# EAGLE schematic HASP_Electronics (EAGLE 9.0.1)
Relay1
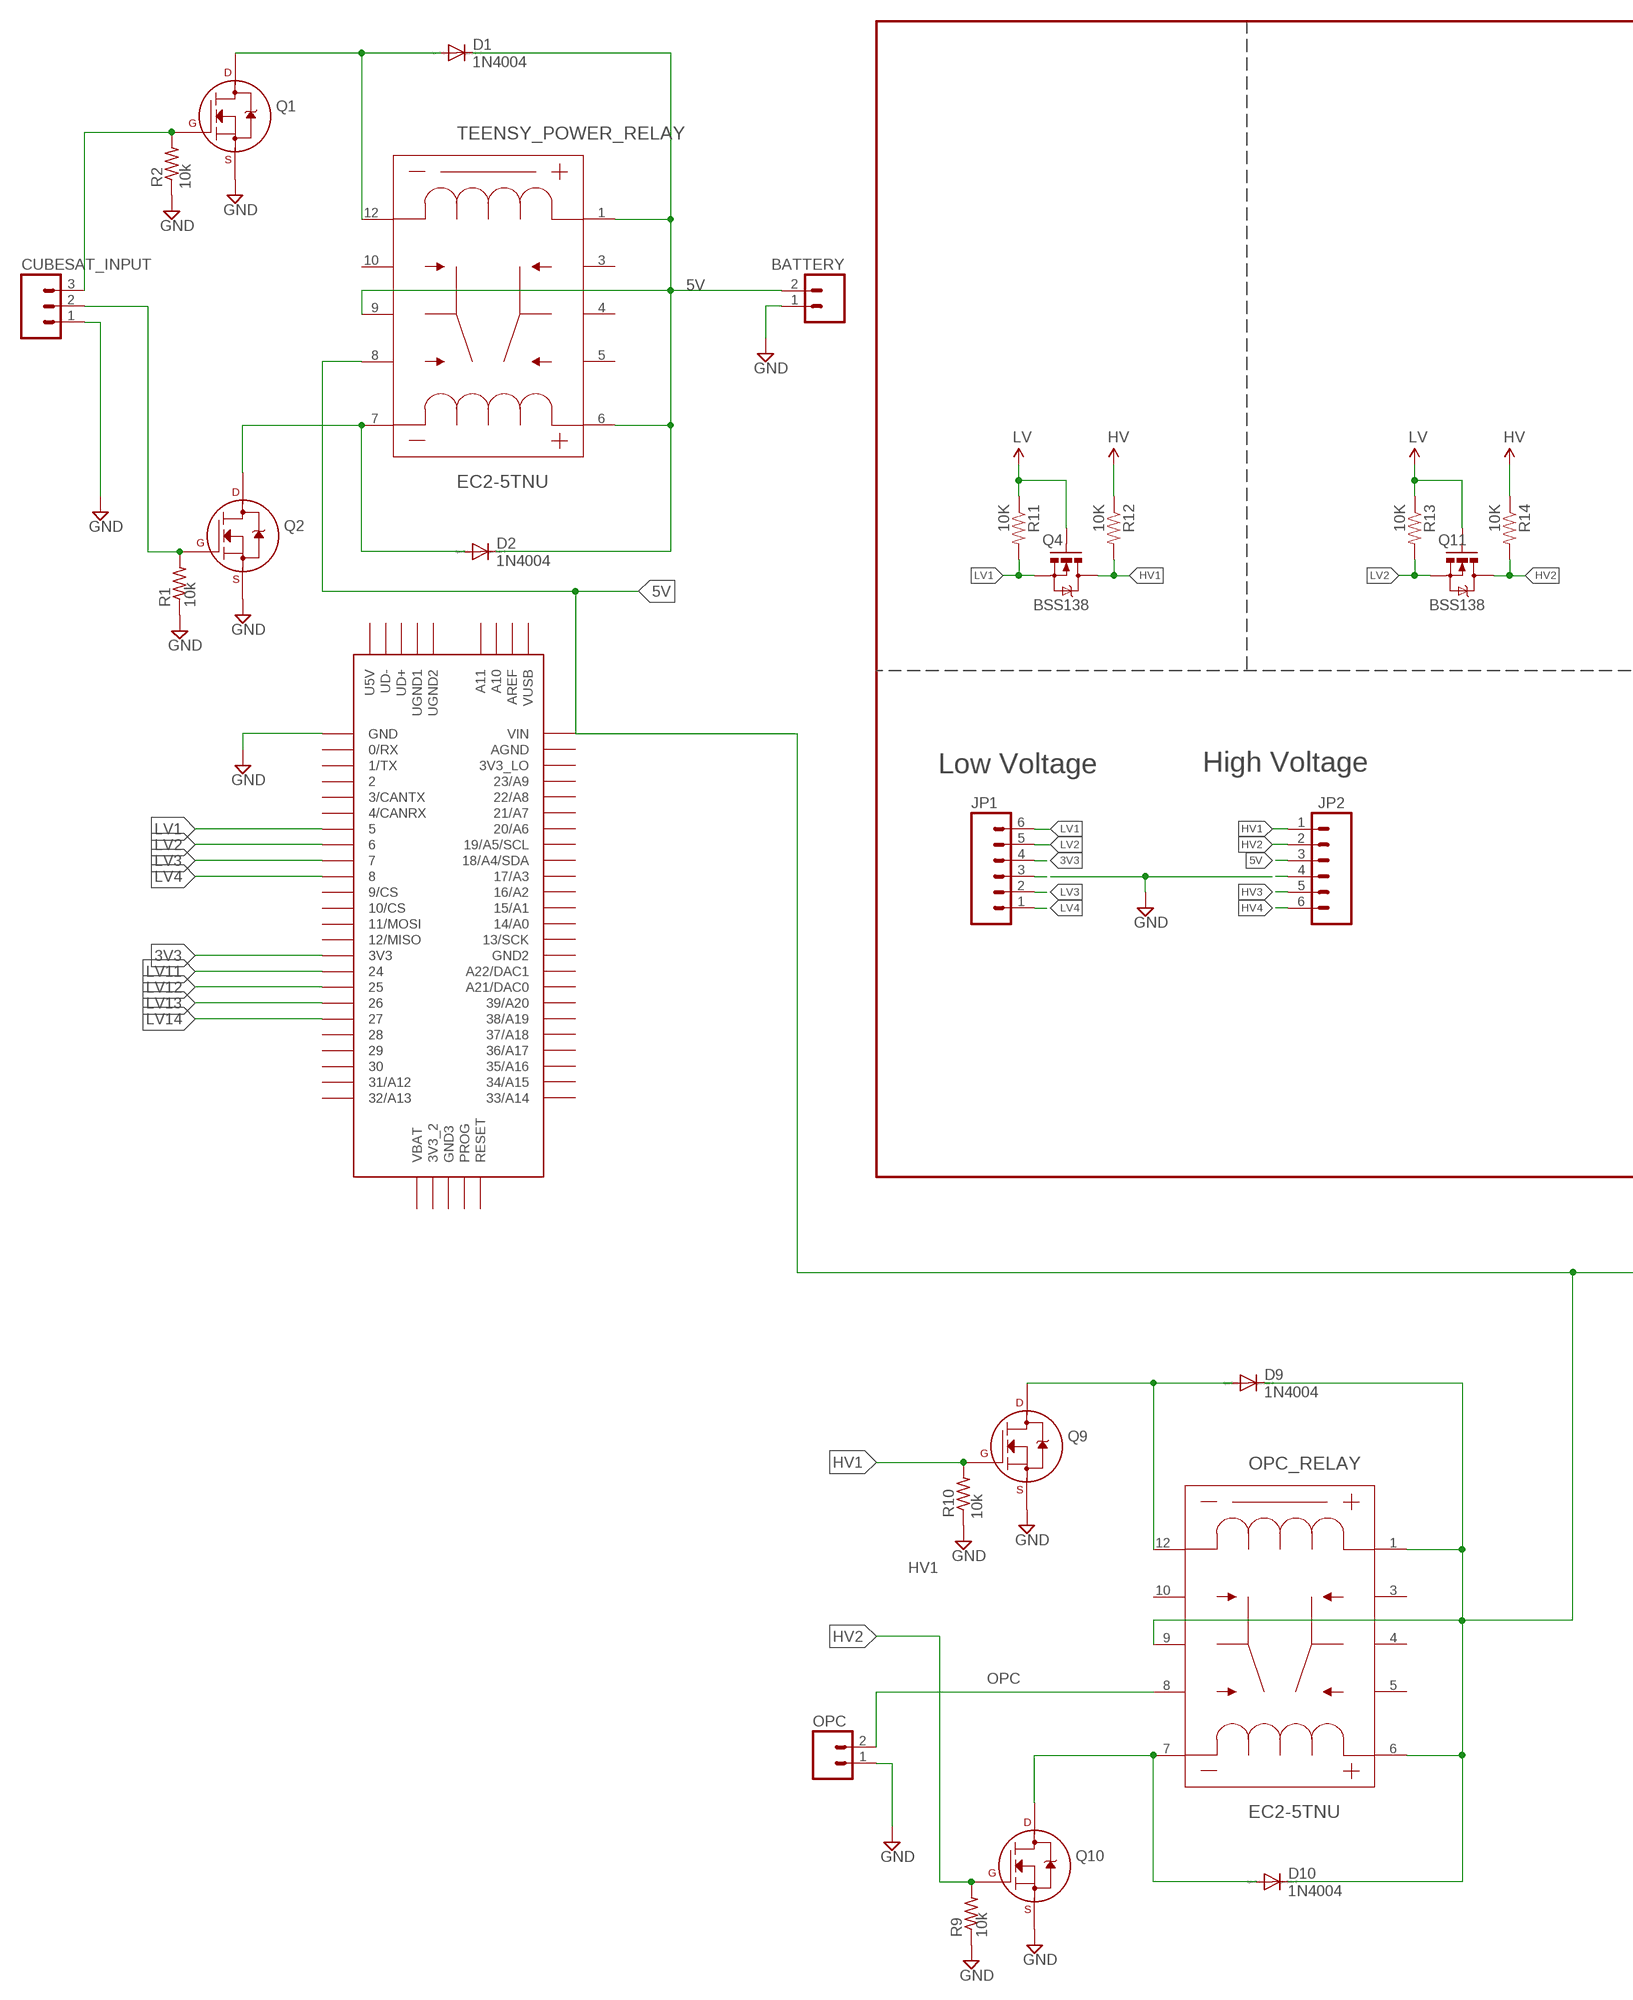
[diagram p0: schematic, sheet 1, part 1 of 2]
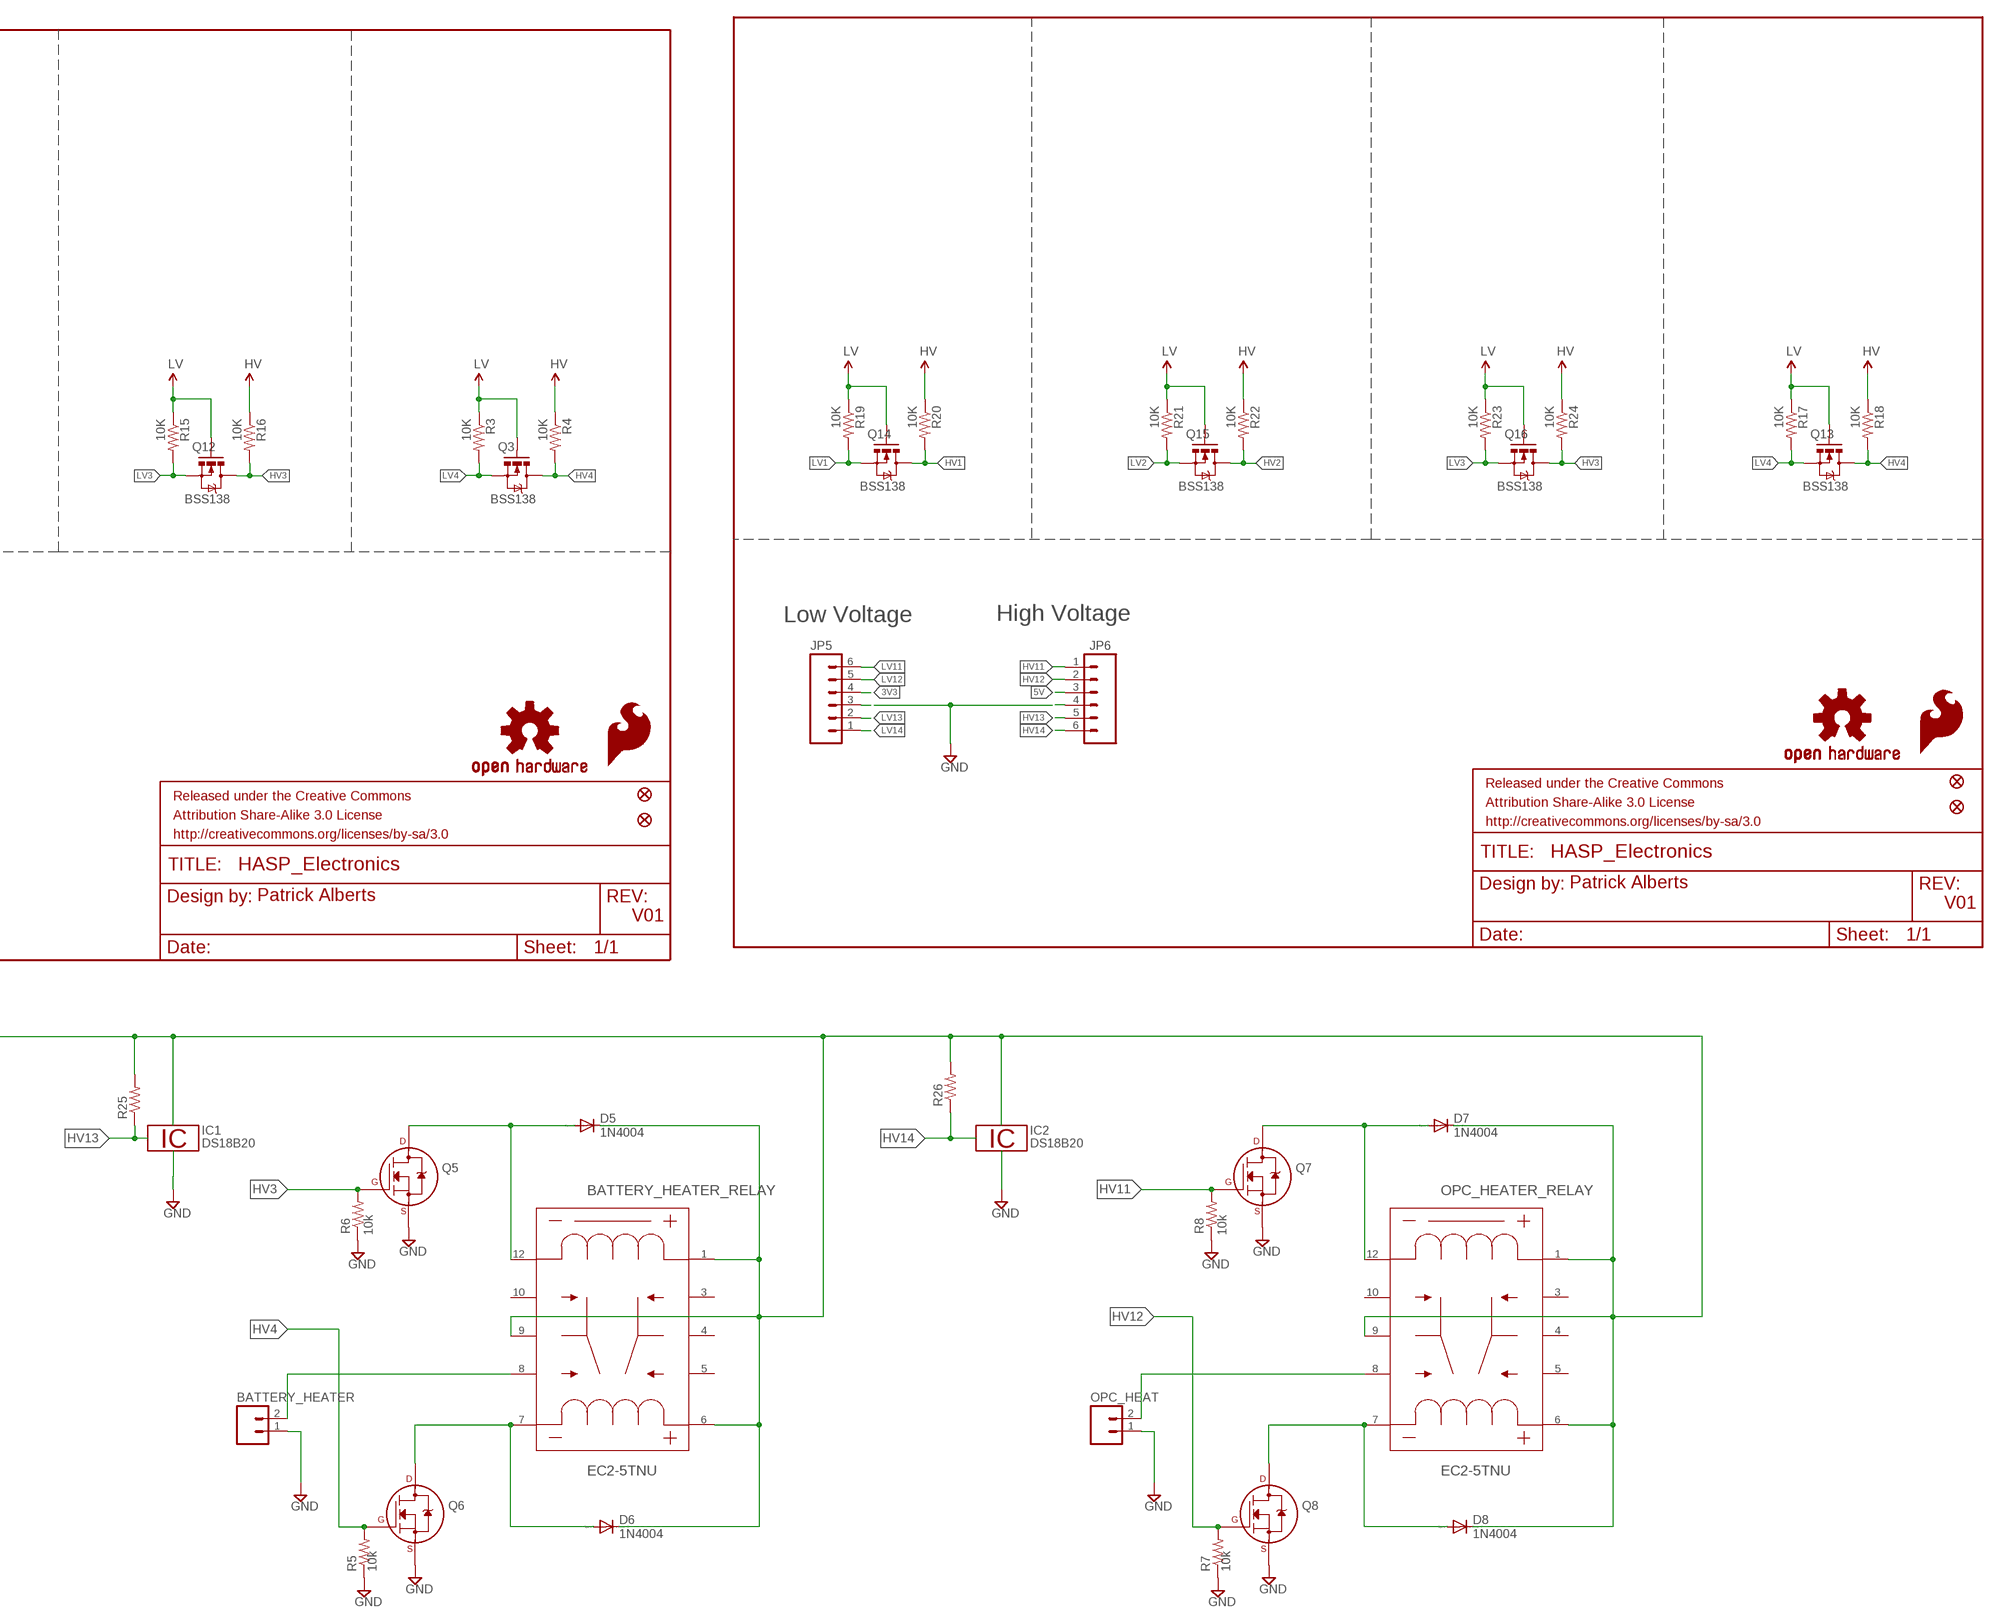
[diagram p1: schematic, sheet 1, part 2 of 2]

## Parts
BATTERY  M02  [02P]
BATTERY_HEATER  M02  [02P]
BATTERY_HEATER_RELAY  EC2-5TNU  [EC2TNU]
CUBESAT_INPUT  M03  [03P]
D1  1N4004  [DO41-10]
D2  1N4004  [DO41-10]
D5  1N4004  [DO41-10]
D6  1N4004  [DO41-10]
D7  1N4004  [DO41-10]
D8  1N4004  [DO41-10]
D9  1N4004  [DO41-10]
D10  1N4004  [DO41-10]
IC1  DS18B20  [TO92-]
IC2  DS18B20  [TO92-]
JP1  M06SIP  [1X06]
JP2  M06SIP  [1X06]
JP3  FIDUCIALUFIDUCIAL  [MICRO-FIDUCIAL]
JP4  FIDUCIALUFIDUCIAL  [MICRO-FIDUCIAL]
JP5  M06SIP  [1X06]
JP6  M06SIP  [1X06]
JP7  FIDUCIALUFIDUCIAL  [MICRO-FIDUCIAL]
JP8  FIDUCIALUFIDUCIAL  [MICRO-FIDUCIAL]
LOGO1  SFE_LOGO_FLAME.1_INCH  [SFE_LOGO_FLAME_.1]
LOGO2  OSHW-LOGOS  [OSHW-LOGO-S]
LOGO3  SFE_LOGO_FLAME.1_INCH  [SFE_LOGO_FLAME_.1]
LOGO4  OSHW-LOGOS  [OSHW-LOGO-S]
OPC  M02  [02P]
OPC_HEAT  M02  [02P]
OPC_HEATER_RELAY  EC2-5TNU  [EC2TNU]
OPC_RELAY  EC2-5TNU  [EC2TNU]
Q1  2N7000_TO92  [TO-92]
Q2  2N7000_TO92  [TO-92]
Q3  BSS138  MOSFET-NCHANNELSMD  [SOT23-3]
Q4  BSS138  MOSFET-NCHANNELSMD  [SOT23-3]
Q5  2N7000_TO92  [TO-92]
Q6  2N7000_TO92  [TO-92]
Q7  2N7000_TO92  [TO-92]
Q8  2N7000_TO92  [TO-92]
Q9  2N7000_TO92  [TO-92]
Q10  2N7000_TO92  [TO-92]
Q11  BSS138  MOSFET-NCHANNELSMD  [SOT23-3]
Q12  BSS138  MOSFET-NCHANNELSMD  [SOT23-3]
Q13  BSS138  MOSFET-NCHANNELSMD  [SOT23-3]
Q14  BSS138  MOSFET-NCHANNELSMD  [SOT23-3]
Q15  BSS138  MOSFET-NCHANNELSMD  [SOT23-3]
Q16  BSS138  MOSFET-NCHANNELSMD  [SOT23-3]
R1  R-US_0207/7  [0207/7]
R2  R-US_0207/7  [0207/7]
R3  10K  RESISTOR0603-RES  [0603-RES]
R4  10K  RESISTOR0603-RES  [0603-RES]
R5  R-US_0207/7  [0207/7]
R6  R-US_0207/7  [0207/7]
R7  R-US_0207/7  [0207/7]
R8  R-US_0207/7  [0207/7]
R9  R-US_0207/7  [0207/7]
R10  R-US_0207/7  [0207/7]
R11  10K  RESISTOR0603-RES  [0603-RES]
R12  10K  RESISTOR0603-RES  [0603-RES]
R13  10K  RESISTOR0603-RES  [0603-RES]
R14  10K  RESISTOR0603-RES  [0603-RES]
R15  10K  RESISTOR0603-RES  [0603-RES]
R16  10K  RESISTOR0603-RES  [0603-RES]
R17  10K  RESISTOR0603-RES  [0603-RES]
R18  10K  RESISTOR0603-RES  [0603-RES]
R19  10K  RESISTOR0603-RES  [0603-RES]
R20  10K  RESISTOR0603-RES  [0603-RES]
R21  10K  RESISTOR0603-RES  [0603-RES]
R22  10K  RESISTOR0603-RES  [0603-RES]
R23  10K  RESISTOR0603-RES  [0603-RES]
R24  10K  RESISTOR0603-RES  [0603-RES]
R25  R-US_0204/7  [0204/7]
R26  R-US_0204/7  [0204/7]
TEENSY_POWER_RELAY  EC2-5TNU  [EC2TNU]
U$1  TEENSY_3.5/3.6  [TEENSY_3.5/3.6]

## Nets
3V3: JP1.4 JP5.4 U$1.3V3
5V [5V_Relay]: BATTERY.2 BATTERY_HEATER_RELAY.1 BATTERY_HEATER_RELAY.6 BATTERY_HEATER_RELAY.9 D1.C D2.C D5.C D6.C D7.C D8.C D9.C D10.C JP2.3 JP6.3 OPC_HEATER_RELAY.1 OPC_HEATER_RELAY.6 OPC_HEATER_RELAY.9 OPC_RELAY.1 OPC_RELAY.6 OPC_RELAY.9 R25.2 R26.2 TEENSY_POWER_RELAY.1 TEENSY_POWER_RELAY.6 TEENSY_POWER_RELAY.8 TEENSY_POWER_RELAY.9 U$1.VIN
BATTERY_HEATER [5V_Relay]: OPC_HEAT.2 OPC_HEATER_RELAY.8
GND [5V_Relay]: BATTERY.1 BATTERY_HEATER.1 CUBESAT_INPUT.1 JP1.3 JP2.4 JP5.3 JP6.4 OPC.1 OPC_HEAT.1 Q1.1(S) Q2.1(S) Q5.1(S) Q6.1(S) Q7.1(S) Q8.1(S) Q9.1(S) Q10.1(S) R1.1 R2.1 R5.1 R6.1 R7.1 R8.1 R9.1 R10.1 U$1.GND
HV: R4.1 R12.1 R14.1 R16.1 R18.1 R20.1 R22.1 R24.1
HV1: JP2.1 Q4.3(D) Q9.2(G) Q14.3(D) R10.2 R12.2 R20.2
HV2: JP2.2 Q10.2(G) Q11.3(D) Q15.3(D) R9.2 R14.2 R22.2
HV3: JP2.5 Q5.2(G) Q12.3(D) Q16.3(D) R6.2 R16.2 R24.2
HV4: JP2.6 Q3.3(D) Q6.2(G) Q13.3(D) R4.2 R5.2 R18.2
HV11: JP6.1 Q7.2(G) R8.2
HV12: JP6.2 Q8.2(G) R7.2
HV13: JP6.5 R25.1
HV14: JP6.6 R26.1
LV: Q3.1(G) Q4.1(G) Q11.1(G) Q12.1(G) Q13.1(G) Q14.1(G) Q15.1(G) Q16.1(G) R3.1 R11.1 R13.1 R15.1 R17.1 R19.1 R21.1 R23.1
LV1: JP1.6 Q4.2(S) Q14.2(S) R11.2 R19.2 U$1.5
LV2: JP1.5 Q11.2(S) Q15.2(S) R13.2 R21.2 U$1.6
LV3: JP1.2 Q12.2(S) Q16.2(S) R15.2 R23.2 U$1.7
LV4: JP1.1 Q3.2(S) Q13.2(S) R3.2 R17.2 U$1.8
LV11: JP5.6 U$1.24
LV12: JP5.5 U$1.25
LV13: JP5.2 U$1.26
LV14: JP5.1 U$1.27
N$1 [5V_Relay]: D1.A Q1.3(D) TEENSY_POWER_RELAY.12
N$3 [5V_Relay]: D2.A Q2.3(D) TEENSY_POWER_RELAY.7
N$8 [5V_Relay]: BATTERY_HEATER_RELAY.12 D5.A Q5.3(D)
N$9 [5V_Relay]: BATTERY_HEATER_RELAY.7 D6.A Q6.3(D)
N$10 [5V_Relay]: D7.A OPC_HEATER_RELAY.12 Q7.3(D)
N$11 [5V_Relay]: D8.A OPC_HEATER_RELAY.7 Q8.3(D)
N$12 [5V_Relay]: D9.A OPC_RELAY.12 Q9.3(D)
N$13 [5V_Relay]: D10.A OPC_RELAY.7 Q10.3(D)
OPC [5V_Relay]: BATTERY_HEATER.2 BATTERY_HEATER_RELAY.8 OPC.2 OPC_RELAY.8
OPC-OFF [5V_Relay]: CUBESAT_INPUT.2 Q2.2(G) R1.2
OPC-ON [5V_Relay]: CUBESAT_INPUT.3 Q1.2(G) R2.2
Unconnected: BATTERY_HEATER_RELAY.3 BATTERY_HEATER_RELAY.4 BATTERY_HEATER_RELAY.5 BATTERY_HEATER_RELAY.10 OPC_HEATER_RELAY.3 OPC_HEATER_RELAY.4 OPC_HEATER_RELAY.5 OPC_HEATER_RELAY.10 OPC_RELAY.3 OPC_RELAY.4 OPC_RELAY.5 OPC_RELAY.10 TEENSY_POWER_RELAY.3 TEENSY_POWER_RELAY.4 TEENSY_POWER_RELAY.5 TEENSY_POWER_RELAY.10 U$1.0/RX U$1.1/TX U$1.2 U$1.3/CANTX U$1.3V3_2 U$1.3V3_LO U$1.4/CANRX U$1.9/CS U$1.10/CS U$1.11/MOSI U$1.12/MISO U$1.13/SCK U$1.14/A0 U$1.15/A1 U$1.16/A2 U$1.17/A3 U$1.18/A4/SDA U$1.19/A5/SCL U$1.20/A6 U$1.21/A7 U$1.21/DAC0(A21/DAC0) U$1.22/A8 U$1.23/A9 U$1.28 U$1.29 U$1.30 U$1.31/A12 U$1.32/A13 U$1.33/A14 U$1.34/A15 U$1.35/A16 U$1.36/A17 U$1.37/A18 U$1.38/A19 U$1.39/A20 U$1.A10 U$1.A11 U$1.A22/DAC1 U$1.AGND U$1.AREF U$1.GND2 U$1.GND3 U$1.PROG U$1.RESET U$1.U5V U$1.UD+ U$1.UD- U$1.UGND1 U$1.UGND2 U$1.VBAT U$1.VUSB

## Notes on the sheet
- 10k
- 10k
- Low Voltage | High Voltage
- Low Voltage | High Voltage
- Patrick Alberts
- Patrick Alberts
- V01
- V01
- 10k | 10k | 10k
- 10k | 10k | 10k

## Power pins joined to a net without a drawn wire
1W: IC1.2 IC2.2
GND: IC1.1 IC2.1
VDD: IC1.3 IC2.3

## Library data of the parts
BATTERY BATTERY_HEATER OPC OPC_HEAT = con-amp-quick:M02: AMP QUICK CONNECTOR; OC_FARNELL: unknown; OC_NEWARK: unknown
BATTERY_HEATER_RELAY OPC_HEATER_RELAY OPC_RELAY TEENSY_POWER_RELAY = EC2-5TNU:EC2-5TNU; MANUFACTURER_PART_NUMBER: EC25TNU; VENDOR: KEMET
CUBESAT_INPUT = con-amp-quick:M03: AMP QUICK CONNECTOR; OC_FARNELL: unknown; OC_NEWARK: unknown
D1 D2 D5-D10 = diode:1N4004: DIODE general purpose rectifier, 1 A
IC1 IC2 = 1wire:DS18B20: Programmable Resolution Digital Thermometer This chip provides a onewire thermosensor with approx. 0.5°C accuracy. A programmable over/undertemperure alarm is available. The precision can be set from 9..12 bits. Notes: Vdd must be applied for accurate measurements at low temperatures, as the parasite power circuit otherwise heats the sensor. If parasite power is used, Vdd has to be connected to GND. The DS1822 is a low-cost thermometer chip, the DS18S20 is similar to the DS18B20, but with 9 Bit precision only. Author: Jan Kandziora <jjj@gmx.de>
JP1 JP2 JP5 JP6 = SparkFun:M06: Header 6 Standard 6-pin 0.1" header. Use with straight break away headers (SKU : PRT-00116), right angle break away headers (PRT-00553), swiss pins (PRT-00743), machine pins (PRT-00117), and female headers (PRT-00115). Molex polarized connector foot print use with SKU : PRT-08094 with associated crimp pins and housings. NOTES ON THE VARIANTS LOCK and LOCK_LONGPADS... This footprint was designed to help hold the alignment of a through-hole component (i.e. 6-pin header) while soldering it into place. You may notice that each hole has been shifted either up or down by 0.005 of an inch from it's more standard position (which is a perfectly straight line). This slight alteration caused the pins (the squares in the middle) to touch the edges of the holes. Because they are alternating, it causes a "brace" to hold the component in place. 0.005 has proven to be the perfect amount of "off-center" position when using our standard breakaway headers. Although looks a little odd when you look at the bare footprint, once you have a header in there, the alteration is very hard to notice. Also, if you push a header all the way into place, it is covered up entirely on the bottom side. This idea of altering the position of holes to aid alignment will be further integrated into the Sparkfun Library for other footprints. It can help hold any component with 3 or more connection pins.
JP3 JP4 JP7 JP8 = SparkFun-Aesthetics:FIDUCIAL: Fiducial Alignment Points Various fiducial points for machine vision alignment.
LOGO1 LOGO3 = SparkFun-Aesthetics:SFE_LOGO_FLAME: SFE Logo, flame only This is the SparkFun flame logo. The logo on the schematic will always be the same size; the package variant is the height of the flame. Default layer for the logo on the board is tSilk.
LOGO2 LOGO4 = SparkFun-Aesthetics:OSHW-LOGO: Open Source Hardware Logo This logo indicates the piece of hardware it is found on incorporates a OSHW license and/or adheres to the definition of open source hardware found here: http://freedomdefined.org/OSHW
Q1 Q2 Q5-Q10 = transistors:2N700*: 2N7000, 2N7002, NDS7002A N-channel enhancement mode MOSFET
Q3 Q4 Q11-Q16 = SparkFun:MOSFET-NCHANNEL
R1 R2 R5-R10 = rcl:R-US_: RESISTOR, American symbol; SPICEPREFIX: R
R3 R4 R11-R24 = SparkFun:RESISTOR: Resistor Basic schematic elements and footprints for 0603, 1206, and PTH resistors.
R25 R26 = resistor:R-US_: RESISTOR, American symbol
U$1 = Teensy356:TEENSY_3.5/3.6

## Net classes
1 5V_Relay: width 0.254 mm, drill 0.889 mm, clearance 0.127 mm